# EAGLE design REGULATOR 230 (EAGLE 8.7.0)
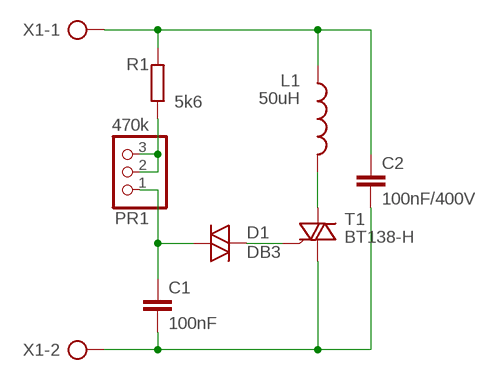
[diagram p0: schematic, sheet 1]

## Parts
C1  100nF  C-EU  [150-72-183]
C2  100nF/400V  C-EU  [150-72-183]
D1  DB3  [DO-35-PION(3MM)]
L1  50uH  L-US  [C5-15]
PR1  470k  PINHD-1X3  [1X03]
R1  5k6  R-EU7  [204/7]
T1  BT138-H  [TO220BH]
X1  AK300/2  [AK300/2]

## Nets
N$1: C2.P$1 L1.P$1 R1.P$2 X1.1
N$2: PR1.2 PR1.3 R1.P$1
N$3: C1.P$1 D1.P$1 PR1.1
N$4: D1.P$2 T1.G
N$5: L1.P$2 T1.T2(A2)
N$6: C1.P$2 C2.P$2 T1.T1(A1) X1.2

## Library data of the parts
C1 C2 = RCL!:C-EU
D1 = triac:DB3
L1 = RCL!:L-US
PR1 = pinhead:PINHD-1X3: PIN HEADER
R1 = RCL!:R-EU
T1 = triac:BT138: TRIAC Source: http://www.semiconductors.philips.com BT138_SERIES_2.pdf
X1 = con-ptr500:AK300/2: CONNECTOR; OC_FARNELL: unknown; OC_NEWARK: unknown

## Board
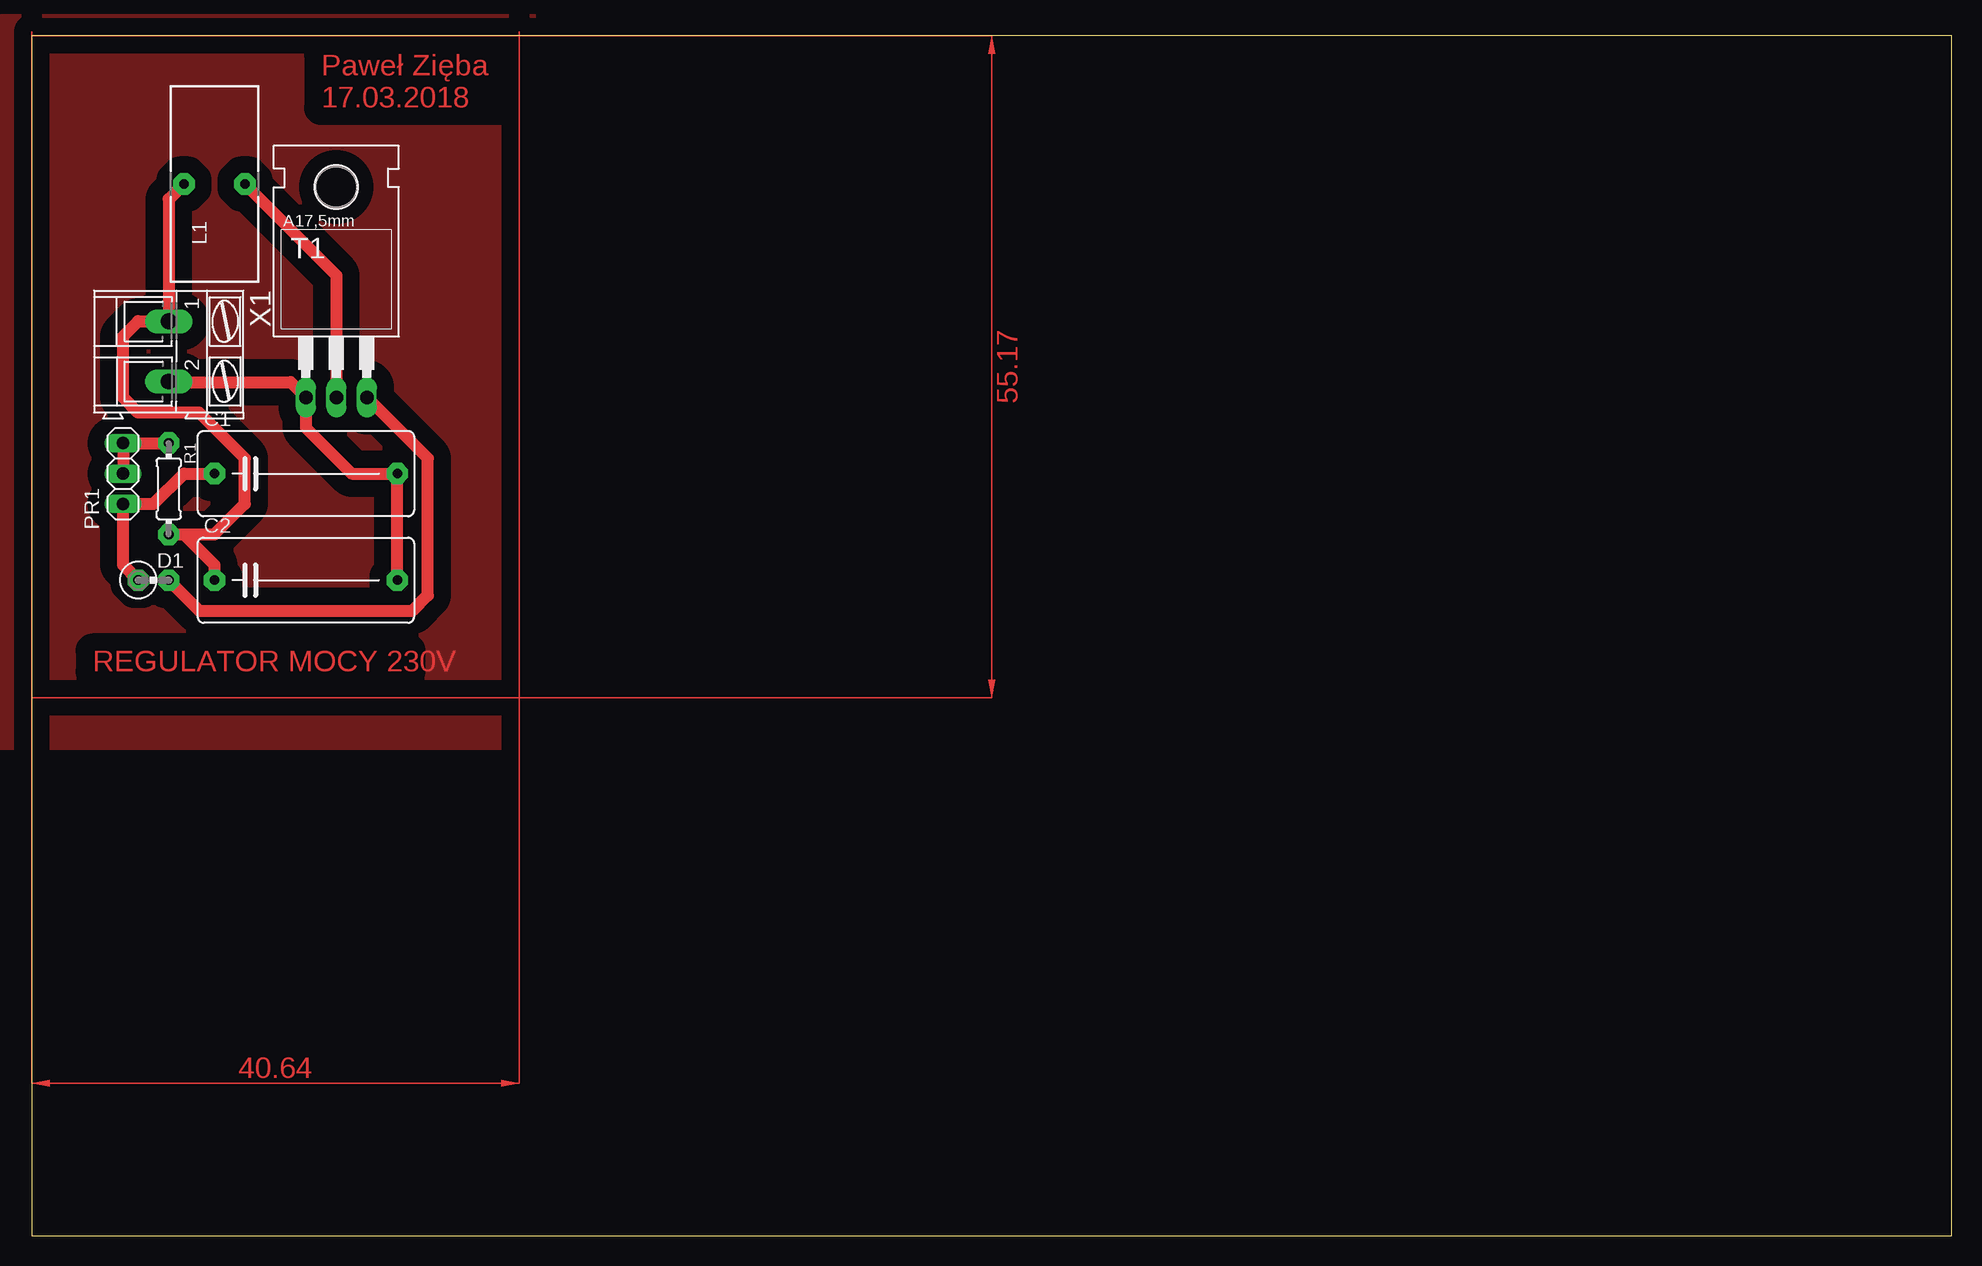
[diagram p1: board, top side]

Size 160 x 100 mm. Coordinates in mm from the lower left corner, seen from the top.
Outline: 0,0 160,0 160,100 0,100 0,0
Copper layers (1*16): Top 0.035mm / dielectric 1.5mm / Bottom 0.035mm
Design rules "default": minimum track width 6mil, minimum drill 0.35mm, track to track 6mil, track to pad 6mil, pad to pad 6mil, via to via 6mil, smd to smd 6mil, copper to edge 40mil, drill to drill 6mil, minimum pad ring 10mil, minimum via ring 8mil, stop-mask expansion 4mil, vias tented up to drill 0mil, thermal gap 10mil

### Footprints (pad centres in the part's own frame; a part is rotated, then mirrored left to right if it is on the bottom)
150-72-183 = drill 0.8 pad 1.778 octagon: P$1 -12.7,-1.27; P$2 2.54,-1.27
DO-35-PION(3MM) = drill 0.8 pad 1.778 octagon: P$1 -1.27,0; P$2 1.27,0
C5-15 = drill 0.8 pad 1.778 octagon: P$1 -2.54,0; P$2 2.54,0
1X03 = drill 1.016 long: 1 -2.54,0; 2 0,0; 3 2.54,0
204/7 = drill 0.8 pad 1.778 octagon: P$1 -3.81,0; P$2 3.81,0
TO220BH = drill 1.118 long: G 2.54,-6.35; T1 -2.54,-6.35; T2 0,-6.35 | hole 3.302: 0,11.176
AK300/2 = drill 1.321 long: 1 -2.515,0; 2 2.489,0

### Placement (x,y rotation side)
C1  27.94,64.77 0 top
C2  27.94,55.88 0 top
D1  10.16,54.61 0 top
L1  15.24,87.63 0 top
PR1  7.62,63.5 90 top
R1  11.43,62.23 270 top
T1  25.4,76.2 0 top
X1  11.43,73.66 270 top

### Tracks (layer width: path | path; a pad name or v marks a point on that pad's centre or on a via)
N$1
  Top 1.016: L1.P$1 11.43,86.36 X1.1 11.4,76.2 8.89,76.2 7.62,74.93 7.62,69.85 8.89,68.58 13.97,68.58 17.78,64.77 17.78,60.96 15.24,58.42 R1.P$2 12.7,58.42 15.24,55.88 C2.P$1
N$2
  Top 1.016: PR1.2 PR1.3 R1.P$1
N$3
  Top 1.016: D1.P$1 7.62,55.88 PR1.1 10.16,60.96 12.7,63.5 C1.P$1
N$4
  Top 1.016: D1.P$2 13.97,52.07 31.75,52.07 33.02,53.34 33.02,64.77 T1.G
N$5
  Top 1.016: L1.P$2 25.4,80.01 T1.T2
N$6
  Top 1.016: C2.P$2 C1.P$2 26.67,63.5 22.86,67.31 T1.T1 21.59,71.12 11.48,71.12 X1.2
N$7
  pour Top (isolate 1.422): 0,101.6 41.91,101.6 41.91,40.64 -2.54,40.64 -2.54,101.6
(copper drawn outside any net)
  shapes: Top area x2

### Text on the board
Top: Paweł Zięba / 17.03.2018 | REGULATOR MOCY 230V